# Altium schematic sheet RTC.SchDoc
size A4; SheetNumber: 3
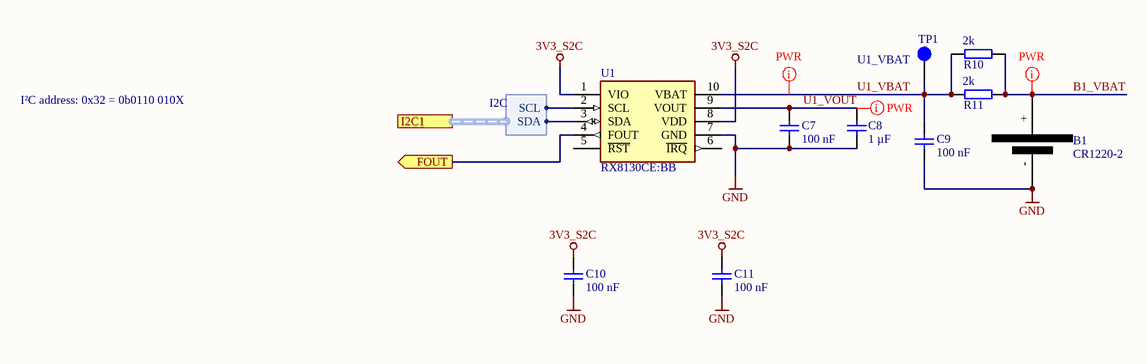
[diagram p0: RTC.SchDoc]

## Parts
B1  CR1220-2  [CR1220]
C7  100 nF  [C_0603_TE]
C8  1 µF  [C_0603_TE]
C9  100 nF  [C_0603_TE]
C10  100 nF  [C_0603_TE]
C11  100 nF  [C_0603_TE]
R10  2k  [R_0603_TE]
R11  2k  [R_0603_TE]
TP1  U1_VBAT  [TP_1mm]  (no BOM)
U1  RX8130CE:BB  [RX8130CE]

## Ports
FOUT (out), I2C1 (harness I2C)

## Harnesses
I2C: SCL, SDA

## Nets
3V3_S2C: C10.1 C11.1 U1.1(VIO) U1.8(VDD)
GND: B1.- C7.2 C8.1 C9.2 C10.2 C11.2 U1.7(GND)
B1_VBAT: B1.+ R10.2 R11.2
FOUT: U1.4(FOUT) ; port FOUT
U1_VBAT: C9.1 R10.1 R11.1 TP1.1 U1.10(VBAT)
U1_VOUT: C7.1 C8.2 U1.9(VOUT)
NetU1_2: U1.2(SCL) ; port I2C1.SCL
NetU1_3: U1.3(SDA) ; port I2C1.SDA

Not connected (* = marked no-connect by the designer): U1 5(~{RST}) 6(~{IRQ})

## Layout directives
net class PWR: B1_VBAT, U1_VBAT, U1_VOUT

## Notes on the sheet
- I²C address: 0x32 = 0b0110 010X
- Title
- Revision:
- Design Engineer:
- Date:
- Project:
- Sheet
- of

## Library data of the parts
B1 = CR1220-2: Battery base CR1220 SMD Button And Strip Battery Connector ROHS; Manufacturer: Q&J; Created from: FRosner; Manufacturer Part Number: CR1220-2; PartID: 36; Created On: 02/07/2024 19:17:25; ComponentLink1Description: Datasheet; ComponentLink1URL: https://wmsc.lcsc.com/wmsc/upload/file/pdf/v2/lcsc/2405081637_Q-J-CR1220-2_C70381.pdf; Component Type: Battery holder; Device Package: SMD; Last Updated: 23/08/2024 11:42:29; Mounting Type: SMD; Operating Temperature: -40 to +85 °C; Supplier 1: LCSC; Supplier Part Number 1: C70381; Type: Battery holder; Live Cycle Status: 1; LCSC Part Number: C70381; Stock number: not stored
C7 C9-C11 = UZgen_C_0603_100nF_50V_X7R: Generic capacitor; Manufacturer: UZgen; Tolerance: 10 %; Voltage: 50V; Created from: AGeiger; Technology: X7R; Value: 100 nF; Manufacturer Part Number: UZgen_C_0603_100nF_50V_X7R; PartID: 1; Created On: 02/07/2024 14:42:23; Device Package: 0603; Mounting Type: SMD; Last Updated: 08/08/2024 15:01:15
C8 = UZgen_C_0603_1uF_16V_X7R: Generic capacitor; Manufacturer: UZgen; Voltage: 16V; Tolerance: 10 %; Created from: UZgenTool; Manufacturer Part Number: UZgen_C_0603_1uF_16V_X7R; PartID: 3783; Created On: 02/08/2024 11:17:59; Value: 1 µF; Device Package: 0603; Technology: X7R; Mounting Type: SMD; Last Updated: 02/08/2024 11:17:59
R10 R11 = UZgen_R_0603_2k: Generic resistor; Manufacturer: UZgen; Tolerance: 1 %; Created from: UZgenTool; Manufacturer Part Number: UZgen_R_0603_2k; PartID: 228; Created On: 02/07/2024 17:29:49; Value: 2k; Device Package: 0603; Mounting Type: SMD; Last Updated: 02/07/2024 17:29:49
TP1 = NULL: Testpoint 1mm; Manufacturer Part Number: NULL; Created from: AGeiger; Created: 2018_06_25_AGeiger; Value: U1_VBAT; PartID: 9; Created On: 20/09/2022 13:14:57; Component Type: Testpoint; Last Updated: 20/09/2022 13:15:39; Manufacturer: NULL; Supplier 1: NULL; Supplier Part Number 1: NULL; Type: Testpoint; Live Cycle Status: 1
U1 = RX8130CE:BB: I2C SMD-10P Real Time Clocks ROHS; Manufacturer: Seiko Epson; Value: 32.768 kHz; Created from: FRosner; Manufacturer Part Number: RX8130CE:BB; PartID: 4; Created On: 26/02/2025 10:16:06; ComponentLink1Description: Datasheet; ComponentLink1URL: https://www.lcsc.com/datasheet/lcsc_datasheet_2105222138_Seiko-Epson-RX8130CE-BB_C1542426.pdf; Component Type: Oscillator; Device Package: SMD-10P; Last Updated: 26/02/2025 10:16:06; Mounting Type: SMD; Operating Temperature: -40 to +85°C; Supplier 1: LCSC; Supplier Part Number 1: C1542426; LCSC Part Number: C1542426